# EAGLE design slang-lsm6dsl-ukazovak (EAGLE 9.4.2)
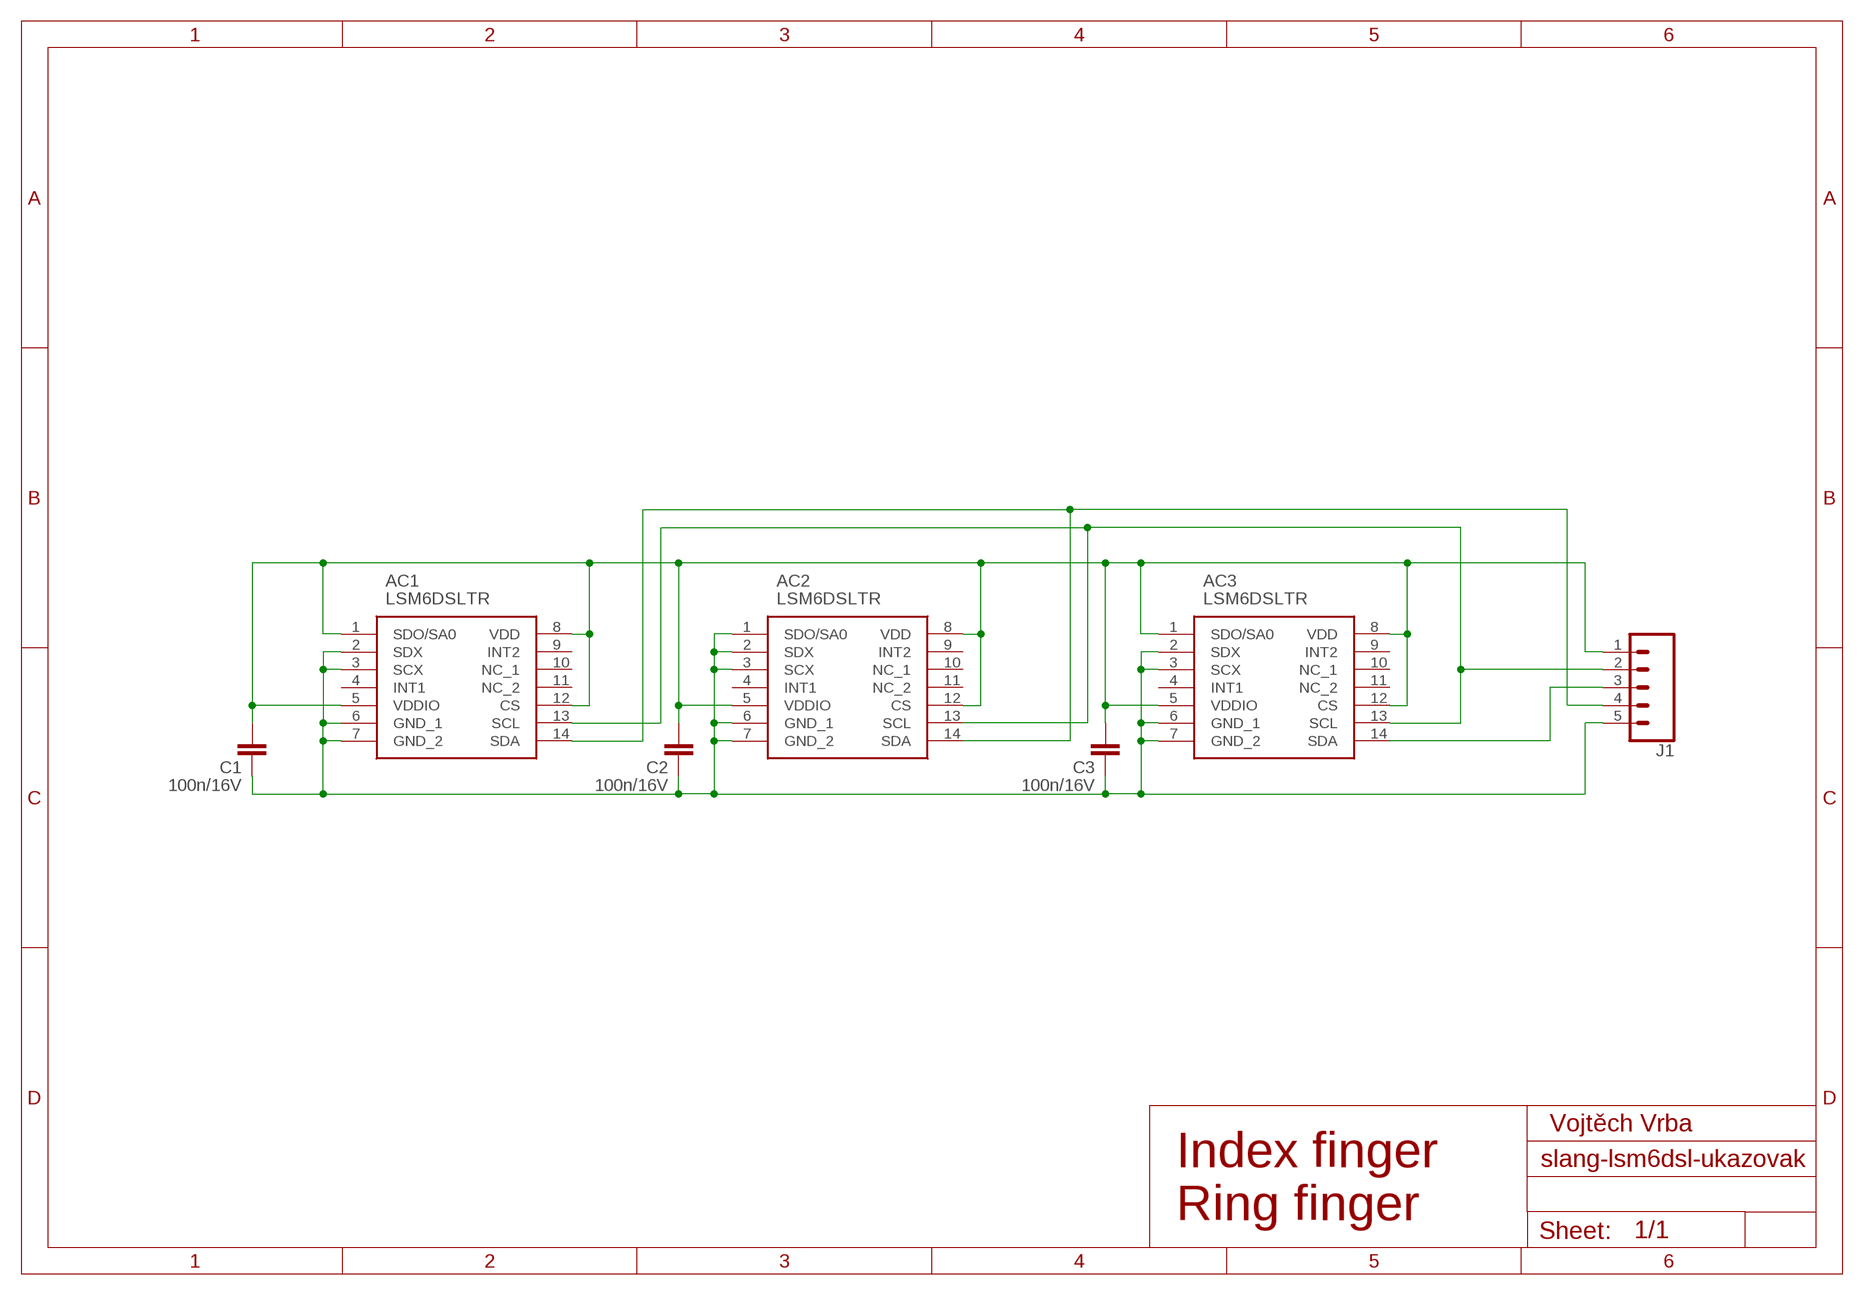
[diagram p0: schematic, sheet 1]

## Parts
AC1  LSM6DSLTR  [LGA-14(2.5X3X0.86)]
AC2  LSM6DSLTR  [LGA-14(2.5X3X0.86)]
AC3  LSM6DSLTR  [LGA-14(2.5X3X0.86)]
C1  100n/16V  C-EUC0603  [C0603]
C2  100n/16V  C-EUC0603  [C0603]
C3  100n/16V  C-EUC0603  [C0603]
J1  CONN_051.27MM  [1X05_1.27MM]

## Nets
GND: AC1.2(SDX) AC1.3(SCX) AC1.6(GND_1) AC1.7(GND_2) AC2.1(SDO/SA0) AC2.2(SDX) AC2.3(SCX) AC2.6(GND_1) AC2.7(GND_2) AC3.2(SDX) AC3.3(SCX) AC3.6(GND_1) AC3.7(GND_2) C1.1 C2.1 C3.1 J1.5
SCL: AC1.13(SCL) AC2.13(SCL) AC3.13(SCL) J1.2
SDA: AC1.14(SDA) AC2.14(SDA) J1.4
SDA2: AC3.14(SDA) J1.3
VDD: AC1.1(SDO/SA0) AC1.5(VDDIO) AC1.8(VDD) AC1.12(CS) AC2.5(VDDIO) AC2.8(VDD) AC2.12(CS) AC3.1(SDO/SA0) AC3.5(VDDIO) AC3.8(VDD) AC3.12(CS) C1.2 C2.2 C3.2 J1.1
Unconnected: AC1.4(INT1) AC1.9(INT2) AC1.10(NC_1) AC1.11(NC_2) AC2.4(INT1) AC2.9(INT2) AC2.10(NC_1) AC2.11(NC_2) AC3.4(INT1) AC3.9(INT2) AC3.10(NC_1) AC3.11(NC_2)

## Notes on the sheet
- Vojtěch Vrba
- Index finger
  Ring finger

## Library data of the parts
AC1-AC3 = LSM6DSLTR:LSM6DSLTR: IMUs - Inertial Measurement Units iNEMO inertial module: 3D accelerometer and 3D gyroscope Source: Datasheet <http://www.st.com/content/ccc/resource/technical/document/datasheet/ee/23/a0/dc/1d/68/45/52/DM00237456.pdf/files/DM00237456.pdf/jcr:content/translations/en.DM00237456.pdf>; ARROW_PART_NUMBER: LSM6DSLTR; ARROW_PRICE-STOCK: https://www.arrow.com/en/products/lsm6dsltr/stmicroelectronics; DESCRIPTION: IMUs - Inertial Measurement Units iNEMO inertial module: 3D accelerometer and 3D gyroscope; HEIGHT: mm; MANUFACTURER_NAME: STMicroelectronics; MANUFACTURER_PART_NUMBER: LSM6DSLTR; RS_PART_NUMBER: 1639811P; RS_PRICE-STOCK: http://uk.rs-online.com/web/p/products/1639811P
C1-C3 = resistor:C-EU: CAPACITOR, European symbol
J1 = SparkFun-Connectors:CONN_05: Multi connection point. Often used as Generic Header-pin footprint for 0.1 inch spaced/style header connections On any of the 0.1 inch spaced packages, you can populate with these: Break Away Headers - Straight <https://www.sparkfun.com/products/116> (PRT-00116) Break Away Male Headers - Right Angle <https://www.sparkfun.com/products/553> (PRT-00553) Female Headers <https://www.sparkfun.com/products/115> (PRT-00115) Break Away Headers - Machine Pin <https://www.sparkfun.com/products/117> (PRT-00117) Break Away Female Headers - Swiss Machine Pin <https://www.sparkfun.com/products/743> (PRT-00743) For SCREWTERMINALS and SPRING TERMINALS visit here: Screw Terimnals on SparkFun.com <https://www.sparkfun.com/search/results?term=Screw+Terminals> (5mm/3.5mm/2.54mm spacing) This device is also useful as a general connection point to wire up your design to another part of your project. Our various solder wires solder well into these plated through hole pads. Hook-Up Wire - Assortment (Stranded, 22 AWG) <https://www.sparkfun.com/products/11375> (PRT-11375) Hook-Up Wire - Assortment (Solid Core, 22 AWG) <https://www.sparkfun.com/products/11367> (PRT-11367) View the entire wire category on our website here <https://www.sparkfun.com/categories/141> Special notes: Molex polarized connector foot print use with SKU : PRT-08231 with associated crimp pins and housings. 1MM SMD Version SKU: PRT-10208

## Board
Positions: 96 mm, 77 mm, 29 mm
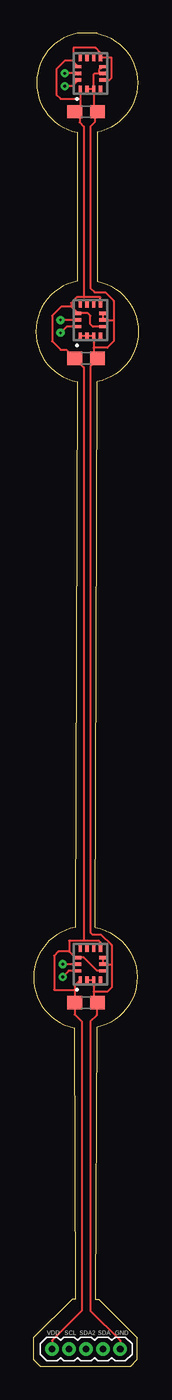
[diagram p1: board, top side]
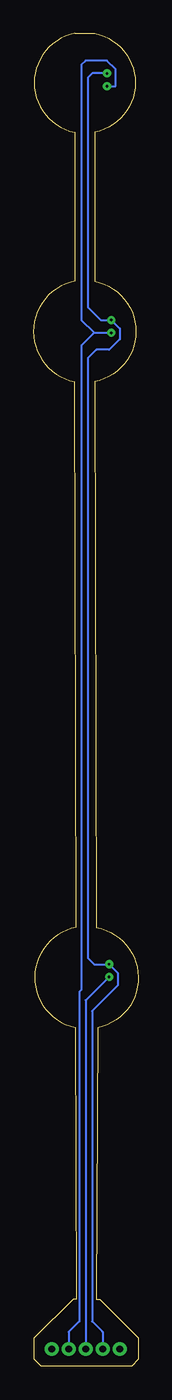
[diagram p2: board, bottom side, seen from below]

Size 7.82 x 99.5 mm. Coordinates in mm from the lower left corner, seen from the top.
Outline: 7.25,0 0.5,0 0,0.5 0,2.12 2.88,5 3.12,5 3.02,25.25 arc-157 3.12,32.75 3.25,73.5 arc-157 3.25,81 3.25,92.12 arc-157 3.25,99.5 4.75,99.5 arc-157 4.75,92.12 4.75,87.88 4.75,81 arc-157 4.75,73.5 4.62,32.75 arc-157 4.72,25.28 4.62,5 4.88,5 7.75,2.12 7.75,0.5 7.25,0
Outline: 7.25,0 7.28,0
Copper layers (1*16): Top 0.035mm / dielectric 1.5mm / Bottom 0.035mm
Design rules "default *": minimum track width 6mil, minimum drill 0.35mm, track to track 6mil, track to pad 6mil, pad to pad 6mil, via to via 6mil, smd to smd 3mil, copper to edge 6mil, drill to drill 6mil, minimum pad ring 10mil, minimum via ring 8mil, stop-mask expansion 4mil, vias tented up to drill 0mil, thermal gap 10mil

### Footprints (pad centres in the part's own frame; a part is rotated, then mirrored left to right if it is on the bottom)
LGA-14(2.5X3X0.86) = smd 0.475 x 0.25: 1 -1.163,0.75; 2 -1.163,0.25; 3 -1.163,-0.25; 4 -1.163,-0.75; 8 1.163,-0.75; 9 1.163,-0.25; 10 1.163,0.25; 11 1.163,0.75 | smd 0.25 x 0.475: 5 -0.5,-0.912; 6 0,-0.912; 7 0.5,-0.912; 12 0.5,0.912; 13 0,0.912; 14 -0.5,0.912
C0603 = smd 1.1 x 1: 1 -0.85,0; 2 0.85,0
1X05_1.27MM = drill 0.508 pad 1: 1 0,0; 2 1.27,0; 3 2.54,0; 4 3.81,0; 5 5.08,0

### Placement (x,y rotation side)
AC1  4.24,96.52 90 top
AC2  4.24,78.11 90 top
AC3  4.24,30 90 top
C1  3.92,93.66 180 top
C2  3.92,75.25 180 top
C3  3.92,27.15 180 top
J1  1.39,1.27 0 top

### Tracks (layer width: path | path; a pad name or v marks a point on that pad's centre or on a via)
GND
  Top 0.152: AC1.2 AC1.3 | AC1.3 4.49,93.94 C1.1 4.78,93.4 4.56,93.19 4.56,92.87 4.24,92.55 4.24,92.08 4.24,80.49 4.56,80.17 5.35,80.17 5.99,79.53 5.99,78.11 | AC1.3 4.49,96.45 4.56,96.52 4.88,96.52 | 4.88,96.52 AC1.6 | AC1.7 4.88,96.74 4.88,96.52 | AC2.1 AC2.2 AC2.3 4.49,76.04 | 4.49,76.04 4.49,75.53 C2.1 4.78,75.14 4.24,74.61 4.24,32.38 4.4,32.23 5.04,32.23 5.83,31.43 5.83,30 | AC2.7 AC2.6 5.99,78.11 | 5.99,78.11 5.99,76.52 5.51,76.04 4.49,76.04 | AC3.2 AC3.3 4.49,27.94 | 4.49,27.94 4.49,27.43 C3.1 4.72,27.09 4.72,26.19 4.24,25.72 4.24,4.13 6.46,1.91 J1.5 | AC3.7 AC3.6 5.83,30 | 5.83,30 5.83,28.26 5.51,27.94 4.49,27.94
SCL  (via drill 0.2)
  Top 0.152: AC1.13 v2.34,96.52 | AC2.13 v2.02,78.11 | AC3.13 v2.18,30
  Bottom 0.152: v2.34,96.52 3.45,96.52 3.77,96.2 3.77,79.06 2.81,78.11 v2.02,78.11 1.39,77.47 1.39,76.68 2.18,75.88 3.13,75.88 3.77,75.25 3.77,30.48 3.29,30 v2.18,30 1.54,29.37 1.54,28.42 3.45,26.51 3.45,3.33 2.66,2.54 J1.2
SDA  (via drill 0.2)
  Top 0.152: AC1.14 2.88,95.57 v2.34,95.57 | AC2.14 2.47,77.61 v2.02,77.15
  Bottom 0.152: v2.34,95.57 1.7,95.57 1.7,96.84 2.34,97.47 3.92,97.47 4.24,97.16 4.24,78.11 3.29,77.15 | 3.29,77.15 v2.02,77.15 | 3.29,77.15 4.24,76.2 4.24,28.1 4.4,27.94 4.4,3.33 5.2,2.54 J1.4
SDA2  (via drill 0.2)
  Top 0.152: AC3.14 2.63,29.5 v2.18,29.05
  Bottom 0.152: v2.18,29.05 3.92,27.3 J1.3
VDD
  Top 0.152: AC1.1 3.49,94.61 | 3.49,94.61 3.49,94.08 C1.2 3.45,93.29 3.45,92.87 3.77,92.55 3.77,79.79 | AC1.5 5.65,96.02 5.83,96.2 5.83,97.69 AC1.8 4.99,98.07 4.64,98.42 2.97,98.42 2.97,97.47 | 2.97,97.47 2.97,97.38 AC1.12 | 2.97,97.47 2.34,97.47 1.7,96.84 1.7,94.93 2.02,94.61 3.49,94.61 | AC2.5 4.42,77.61 4.24,77.79 4.24,78.42 4.06,78.61 AC2.12 2.81,79.12 | AC2.8 4.99,79.79 3.77,79.79 | 3.77,79.79 3.23,79.79 2.81,79.38 2.81,79.12 | 2.81,79.12 2.08,79.12 1.39,78.42 1.39,76.52 2.02,75.88 2.44,75.88 C2.2 3.77,74.56 3.77,31.75 | AC3.1 3.08,28.42 3.08,28.1 | 3.08,28.1 C3.2 3.08,26.25 3.61,25.72 3.61,4.13 1.39,1.91 J1.1 | AC3.5 4.74,29.5 3.74,30.5 3.45,30.5 | 3.45,30.5 AC3.12 | AC3.8 4.99,31.64 4.88,31.75 3.77,31.75 | 3.77,31.75 2.66,31.75 2.66,30.96 | 3.45,30.5 3.11,30.5 2.66,30.96 | 2.66,30.96 1.86,30.96 1.54,30.64 1.54,28.1 3.08,28.1

### Text on the board
tNames: VDD | SCL | SDA2 | SDA | GND